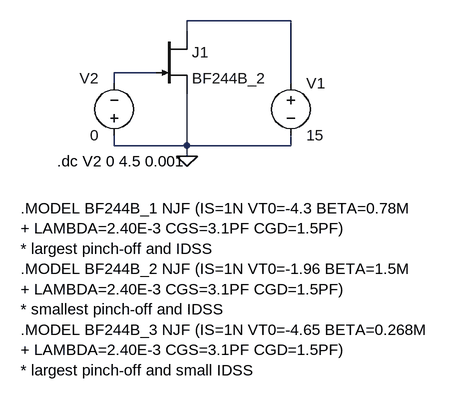
[diagram p0: schematic jfet_char.asc]
jfet_char.asc, the LTspice schematic file:
Version 4
SHEET 1 880 756
WIRE 272 144 112 144
WIRE 112 160 112 144
WIRE 64 224 0 224
WIRE 0 240 0 224
WIRE 272 240 272 144
WIRE 0 336 0 320
WIRE 112 336 112 256
WIRE 112 336 0 336
WIRE 272 336 272 320
WIRE 272 336 112 336
WIRE 112 352 112 336
FLAG 112 352 0
SYMBOL njf 64 160 R0
SYMATTR InstName J1
SYMATTR Value BF244B_2
SYMBOL voltage 272 224 R0
WINDOW 123 0 0 Left 0
WINDOW 39 0 0 Left 0
SYMATTR InstName V1
SYMATTR Value 15
SYMBOL voltage 0 336 R180
WINDOW 0 24 104 Left 0
WINDOW 3 24 16 Left 0
WINDOW 123 0 0 Left 0
WINDOW 39 0 0 Left 0
SYMATTR InstName V2
SYMATTR Value 0
TEXT -144 432 Left 0 !.MODEL BF244B_1 NJF (IS=1N VT0=-4.3 BETA=0.78M  \n+ LAMBDA=2.40E-3 CGS=3.1PF CGD=1.5PF)\n* largest pinch-off and IDSS\n.MODEL BF244B_2 NJF (IS=1N VT0=-1.96 BETA=1.5M\n+ LAMBDA=2.40E-3 CGS=3.1PF CGD=1.5PF)\n* smallest pinch-off and IDSS\n.MODEL BF244B_3 NJF (IS=1N VT0=-4.65 BETA=0.268M  \n+ LAMBDA=2.40E-3 CGS=3.1PF CGD=1.5PF)\n* largest pinch-off and small IDSS
TEXT -88 360 Left 0 !.dc V2 0 4.5 0.001

The netlist it stands for:
* jfet_char.asc
J1 N001 N002 0 BF244B_2
V1 N001 0 15
V2 0 N002 0
.model NJF NJF
.model PJF PJF
.lib standard.jft
.MODEL BF244B_1 NJF (IS=1N VT0=-4.3 BETA=0.78M
+ LAMBDA=2.40E-3 CGS=3.1PF CGD=1.5PF)
* largest pinch-off and IDSS
.MODEL BF244B_2 NJF (IS=1N VT0=-1.96 BETA=1.5M
+ LAMBDA=2.40E-3 CGS=3.1PF CGD=1.5PF)
* smallest pinch-off and IDSS
.MODEL BF244B_3 NJF (IS=1N VT0=-4.65 BETA=0.268M
+ LAMBDA=2.40E-3 CGS=3.1PF CGD=1.5PF)
* largest pinch-off and small IDSS
.dc V2 0 4.5 0.001
.backanno
.end